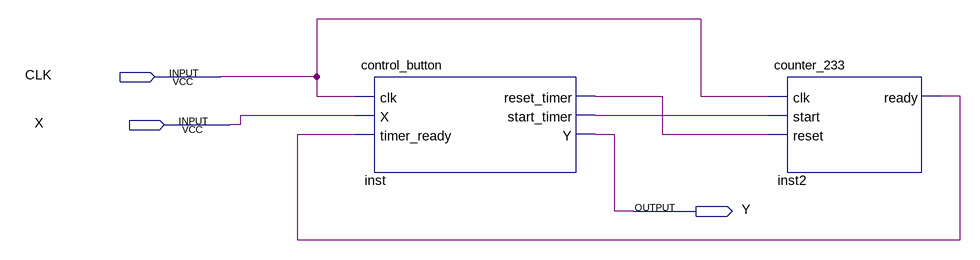
[diagram p0: schematic sheet]
// Quartus schematic TopLevel.bdf as structural Verilog: 2 symbols, 3 pins
module TopLevel (
  input  CLK,
  input  X,
  output Y
);

  wire inst2_ready, inst_reset_timer, inst_start_timer;

  control_button inst (
    .clk(CLK), .X(X), .timer_ready(inst2_ready), .reset_timer(inst_reset_timer),
    .start_timer(inst_start_timer), .Y(Y));
  counter_233 inst2 (.clk(CLK), .start(inst_start_timer), .reset(inst_reset_timer), .ready(inst2_ready));
endmodule
